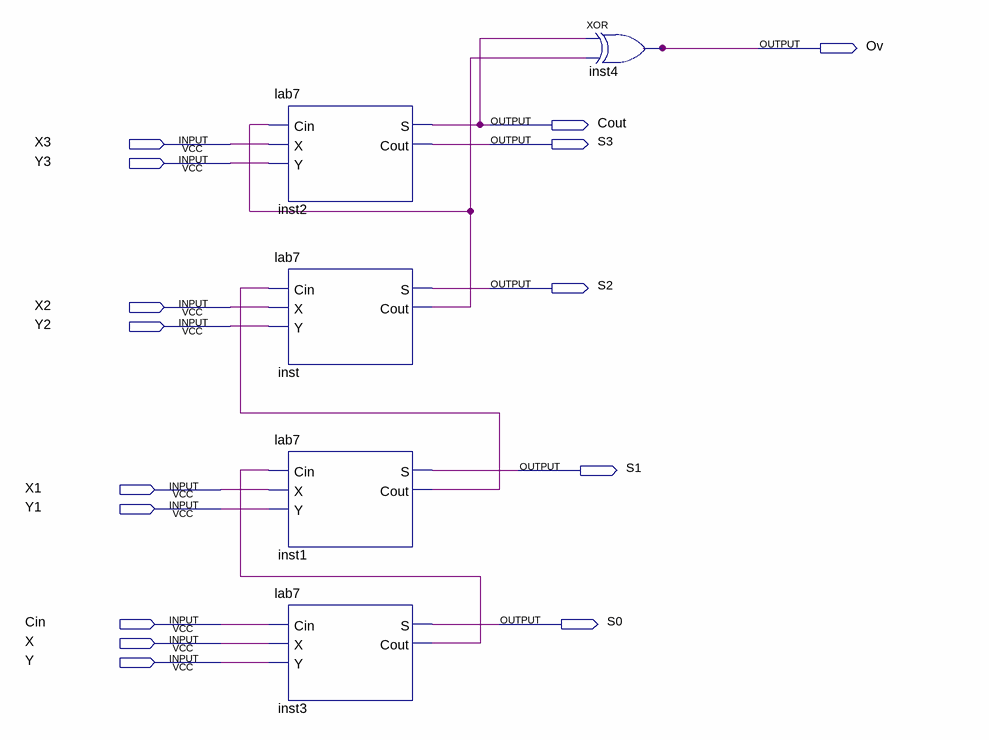
[diagram p0: schematic sheet]
// Quartus schematic lab74bit.bdf as structural Verilog: 5 symbols, 15 pins
module lab74bit (
  input  X3,
  input  Y3,
  input  X2,
  input  Y2,
  input  X1,
  input  Y1,
  input  Cin,
  input  X,
  input  Y,
  output Ov,
  output Cout,
  output S3,
  output S2,
  output S1,
  output S0
);

  wire inst1_cout, inst3_cout, inst_cout;

  lab7 inst2 (.Cin(inst_cout), .X(X3), .Y(Y3), .S(Cout), .Cout(S3));
  lab7 inst (.Cin(inst1_cout), .X(X2), .Y(Y2), .S(S2), .Cout(inst_cout));
  lab7 inst1 (.Cin(inst3_cout), .X(X1), .Y(Y1), .S(S1), .Cout(inst1_cout));
  lab7 inst3 (.Cin(Cin), .X(X), .Y(Y), .S(S0), .Cout(inst3_cout));
  xor inst4 (Ov, Cout, inst_cout);
endmodule
